# Altium schematic sheet PROGRAM.SchDoc
size A; SheetNumber: 9; SheetTotal: 10
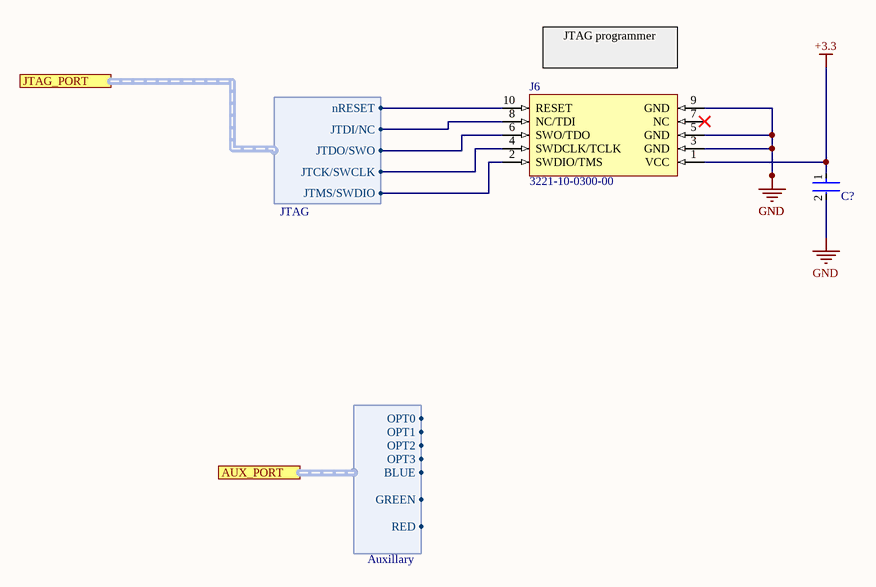
[diagram p0: PROGRAM.SchDoc]

## Parts
C?  C0603C104K5RAC7411  [FP-C0603C-CF-IPC_B]  (value not drawn)
J6  3221-10-0300-00  [3221-10-0300-00-Footprint-1]

## Ports
AUX_PORT (harness Auxillary), JTAG_PORT (harness JTAG)

## Harnesses
Auxillary: OPT0, OPT1, RED, GREEN, BLUE, OPT2, OPT3
JTAG: JTMS/SWDIO, JTCK/SWCLK, JTDO/SWO, JTDI/NC, nRESET

## Nets
+3.3: C?.1 J6.1(VCC)
GND: C?.2 J6.3(GND) J6.5(GND) J6.9(GND)
NetJ6_2: J6.2(SWDIO/TMS) ; port JTAG_PORT.JTMS/SWDIO
NetJ6_4: J6.4(SWDCLK/TCLK) ; port JTAG_PORT.JTCK/SWCLK
NetJ6_6: J6.6(SWO/TDO) ; port JTAG_PORT.JTDO/SWO
NetJ6_8: J6.8(NC/TDI) ; port JTAG_PORT.JTDI/NC
NetJ6_10: J6.10(RESET) ; port JTAG_PORT.nRESET

Not connected (* = marked no-connect by the designer): J6 7(NC)*

## Notes on the sheet
- (near J6) JTAG programmer

## Library data of the parts
C? = CMP-001-00083-3: Cap Ceramic 0.1uF 50V X7R 10% SMD 0603 125C T/R
J6 = CMP-002-00077-1: JTAG STLINK CONN HEADER SMD 10POS 1.27MM